# EAGLE schematic M8340E (EAGLE 6.6.0)
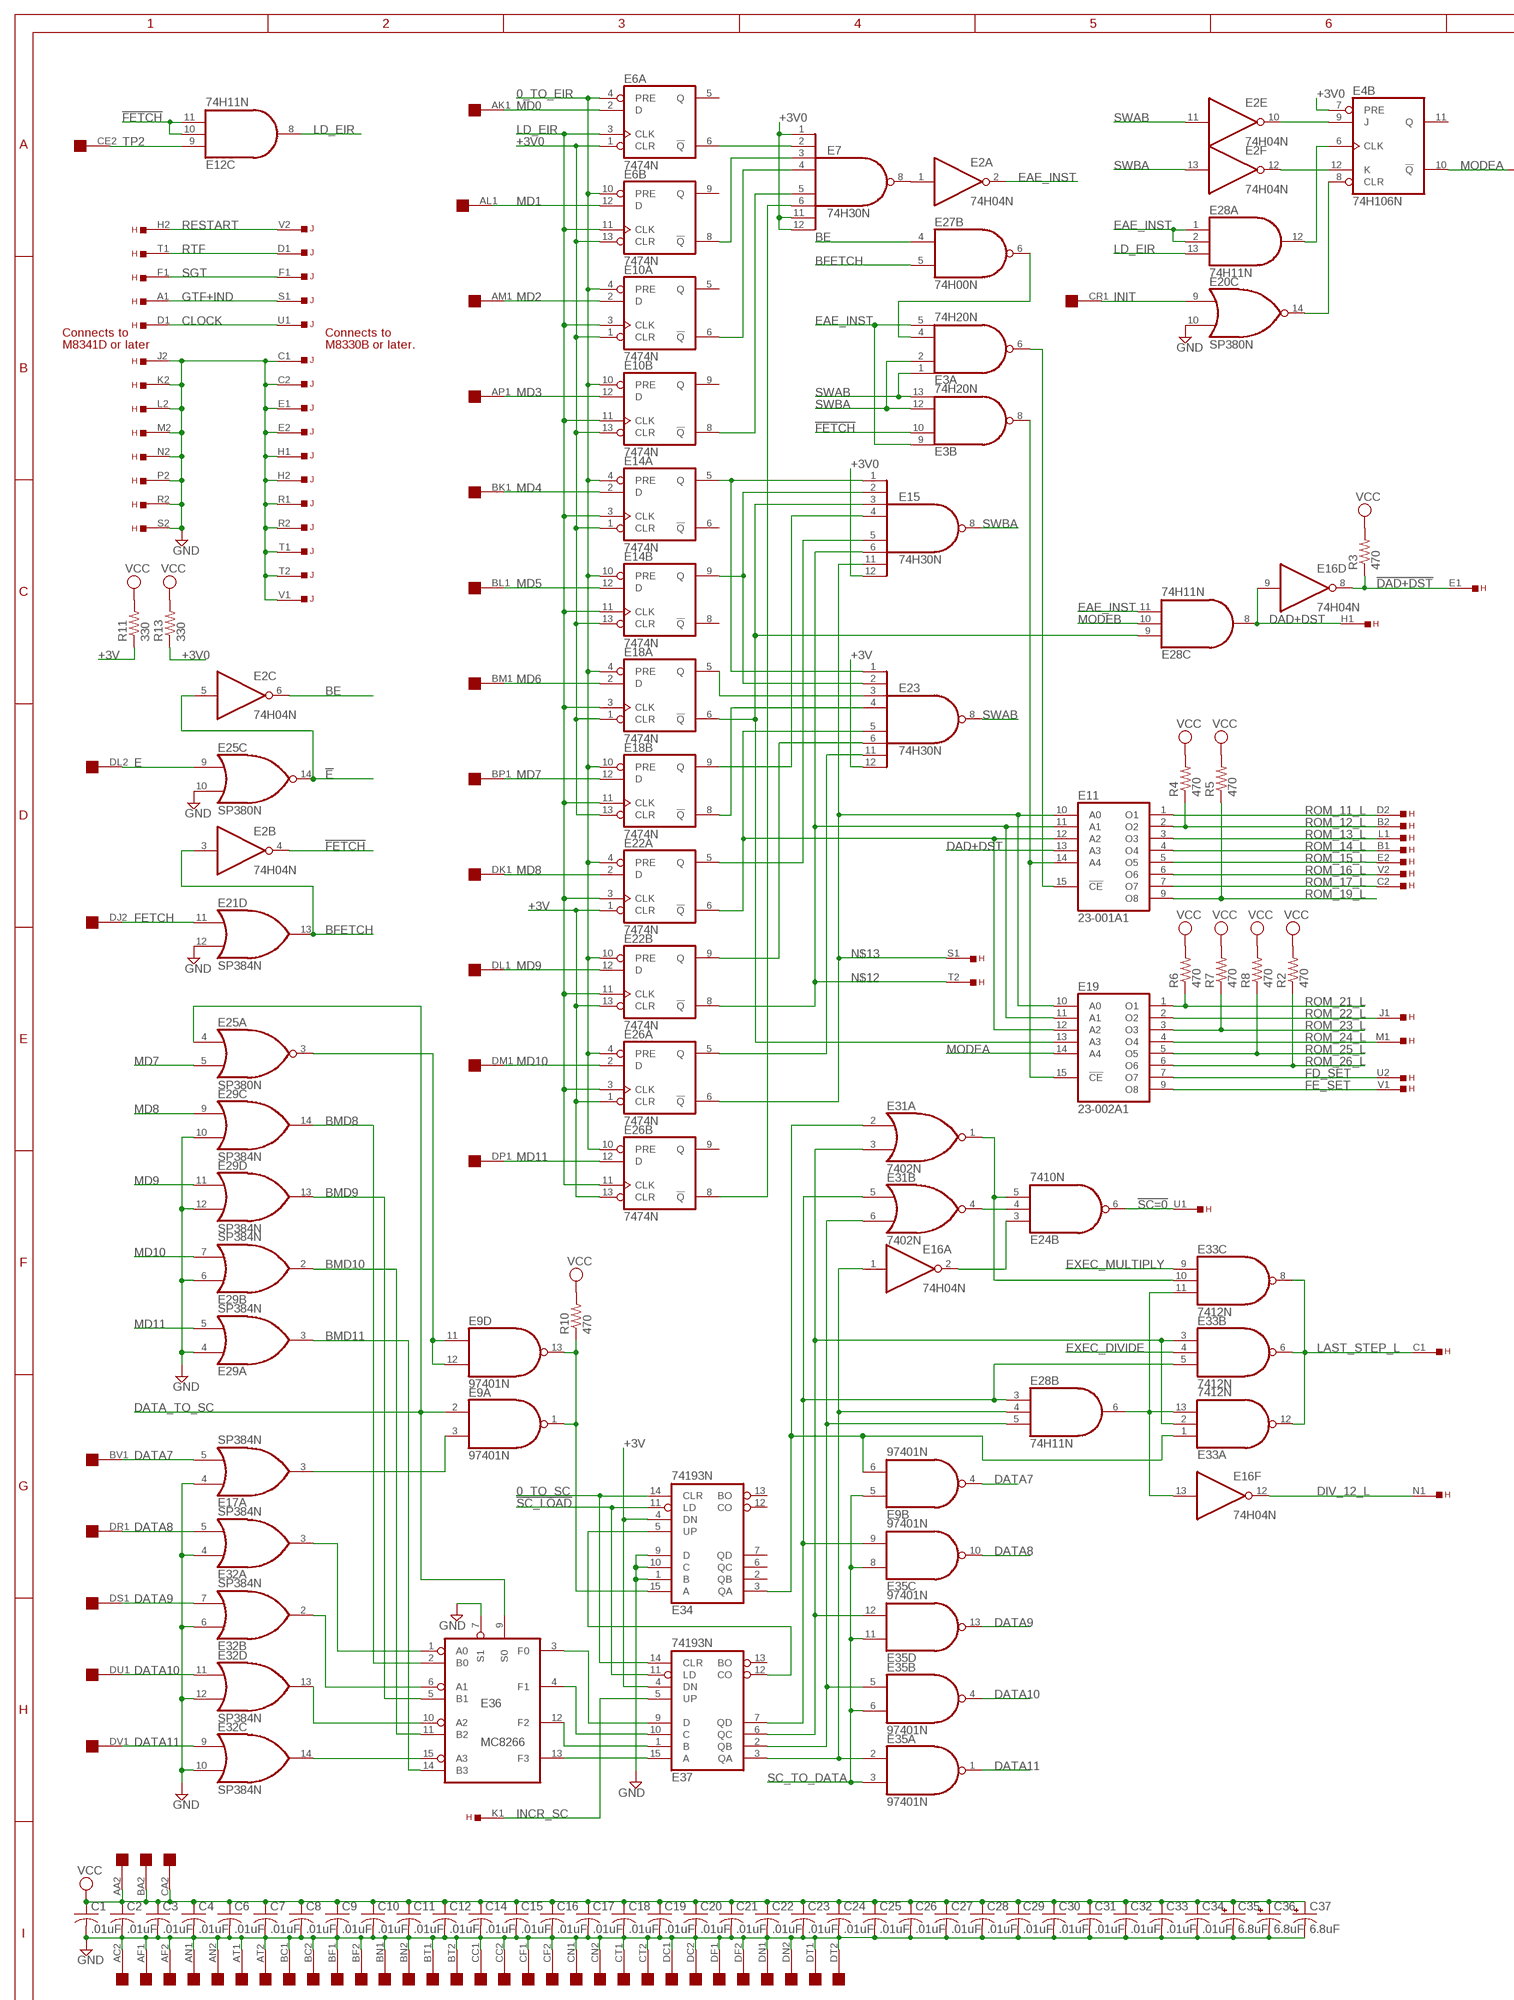
[diagram p0: schematic, sheet 1, part 1 of 2]
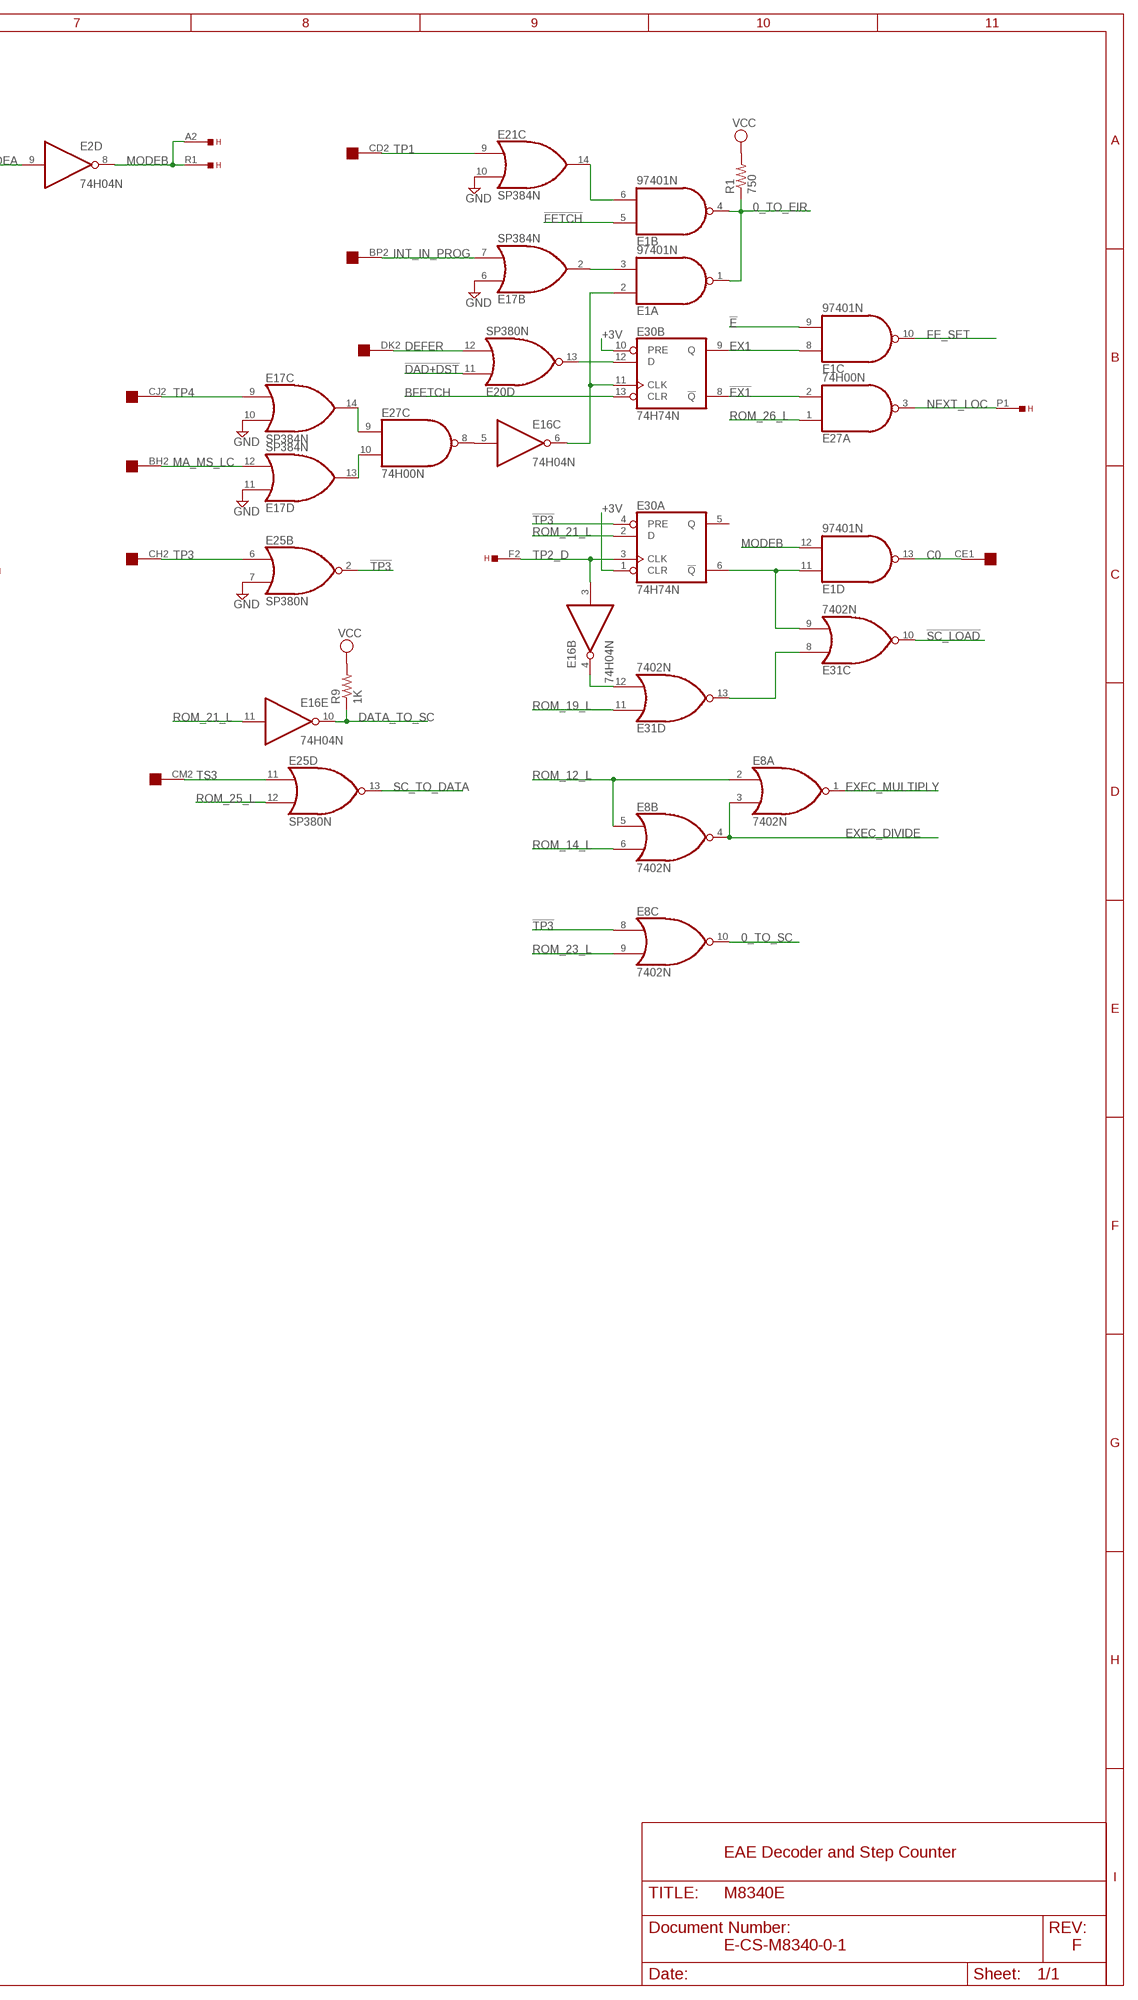
[diagram p1: schematic, sheet 1, part 2 of 2]

## Parts
C1  .01uF  C-US  [C063-025X075]
C2  .01uF  C-US  [C063-025X075]
C3  .01uF  C-US  [C063-025X075]
C4  .01uF  C-US  [C063-025X075]
C6  .01uF  C-US  [C063-025X075]
C7  .01uF  C-US  [C063-025X075]
C8  .01uF  C-US  [C063-025X075]
C9  .01uF  C-US  [C063-025X075]
C10  .01uF  C-US  [C063-025X075]
C11  .01uF  C-US  [C063-025X075]
C12  .01uF  C-US  [C063-025X075]
C14  .01uF  C-US  [C063-025X075]
C15  .01uF  C-US  [C063-025X075]
C16  .01uF  C-US  [C063-025X075]
C17  .01uF  C-US  [C063-025X075]
C18  .01uF  C-US  [C063-025X075]
C19  .01uF  C-US  [C063-025X075]
C20  .01uF  C-US  [C063-025X075]
C21  .01uF  C-US  [C063-025X075]
C22  .01uF  C-US  [C063-025X075]
C23  .01uF  C-US  [C063-025X075]
C24  .01uF  C-US  [C063-025X075]
C25  .01uF  C-US  [C063-025X075]
C26  .01uF  C-US  [C063-025X075]
C27  .01uF  C-US  [C063-025X075]
C28  .01uF  C-US  [C063-025X075]
C29  .01uF  C-US  [C063-025X075]
C30  .01uF  C-US  [C063-025X075]
C31  .01uF  C-US  [C063-025X075]
C32  .01uF  C-US  [C063-025X075]
C33  .01uF  C-US  [C063-025X075]
C34  .01uF  C-US  [C063-025X075]
C35  6.8uF  CPOL-USE20-8AXIAL  [E12-8]
C36  6.8uF  CPOL-USE20-8AXIAL  [E12-8]
C37  6.8uF  CPOL-USE20-8AXIAL  [E12-8]
E1  97401N  74LS01N  [DIL14]
E2  74H04N  7404N  [DIL14]
E3  74H20N  7420N  [DIL14]
E4  74H106N  7476N  [DIL16]
E6  7474N  74S74N  [DIL14]
E7  74H30N  7430N  [DIL14]
E8  7402N  [DIL14]
E9  97401N  74LS01N  [DIL14]
E10  7474N  74S74N  [DIL14]
E11  23-001A1  5600  [DIL16]
E12  74H11N  74S11N  [DIL14]
E14  7474N  74S74N  [DIL14]
E15  74H30N  7430N  [DIL14]
E16  74H04N  7404N  [DIL14]
E17  SP384N  [DIL14]
E18  7474N  74S74N  [DIL14]
E19  23-002A1  5600  [DIL16]
E20  SP380N  [DIL14]
E21  SP384N  [DIL14]
E22  7474N  74S74N  [DIL14]
E23  74H30N  7430N  [DIL14]
E24  7410N  [DIL14]
E25  SP380N  [DIL14]
E26  7474N  74S74N  [DIL14]
E27  74H00N  7400N  [DIL14]
E28  74H11N  74S11N  [DIL14]
E29  SP384N  [DIL14]
E30  74H74N  74S74N  [DIL14]
E31  7402N  [DIL14]
E32  SP384N  [DIL14]
E33  7412N  [DIL14]
E34  74193N  [DIL16]
E35  97401N  74LS01N  [DIL14]
E36  MC8266  [DIL16]
E37  74193N  [DIL16]
H  EDGE-TOP  [EDGE-CON2]
J  EDGE-TOP  [EDGE-CON2]
R1  750  R-US_0207/10  [0207/10]
R2  470  R-US_0207/10  [0207/10]
R3  470  R-US_0207/10  [0207/10]
R4  470  R-US_0207/10  [0207/10]
R5  470  R-US_0207/10  [0207/10]
R6  470  R-US_0207/10  [0207/10]
R7  470  R-US_0207/10  [0207/10]
R8  470  R-US_0207/10  [0207/10]
R9  1K  R-US_0207/10  [0207/10]
R10  470  R-US_0207/10  [0207/10]
R11  330  R-US_0207/10  [0207/10]
R13  330  R-US_0207/10  [0207/10]
U$2  QUAD  [EDGE-CON8]

## Nets
0_TO_EIR: E1.1(A:O) E1.4(B:O) E6.4(A:PRE) E6.10(B:PRE) E10.4(A:PRE) E10.10(B:PRE) E14.4(A:PRE) E14.10(B:PRE) E18.4(A:PRE) E18.10(B:PRE) E22.4(A:PRE) E22.10(B:PRE) E26.4(A:PRE) E26.10(B:PRE) R1.1
0_TO_SC: E8.10(C:O) E34.14(CLR) E37.14(CLR)
!DAD+DST: E16.8(D:O) E20.11(D:I0) H.E1 R3.1
!E: E1.9(C:I1) E2.5(C:I) E25.14(C:O)
!EX1: E27.2(A:I1) E30.8(B:!Q)
!FETCH: E1.5(B:I0) E2.4(B:O) E3.10(B:I1) E12.10(C:I1) E12.11(C:I2)
!INIT: E4.8(B:CLR) E20.14(C:O)
!SC=0: E24.6(B:O) H.U1
!SC_LOAD: E31.10(C:O) E34.11(LD) E37.11(LD)
!TP3: E8.8(C:I0) E25.2(B:O) E30.4(A:PRE)
+3V: E22.1(A:CLR) E22.13(B:CLR) E23.12(I7) E26.1(A:CLR) E26.13(B:CLR) E30.1(A:CLR) E30.10(B:PRE) E34.4(DN) E37.4(DN) R11.1
+3V0: E4.7(B:PRE) E6.1(A:CLR) E6.13(B:CLR) E7.1(I0) E7.11(I6) E7.12(I7) E10.1(A:CLR) E10.13(B:CLR) E14.1(A:CLR) E14.13(B:CLR) E15.12(I7) E18.1(A:CLR) E18.13(B:CLR) R13.1
BE: E2.6(C:O) E27.4(B:I0)
BFETCH: E2.3(B:I) E21.13(D:O) E27.5(B:I1) E30.13(B:CLR)
BMD8: E29.14(C:O) E36.2(B0)
BMD9: E29.13(D:O) E36.5(B1)
BMD10: E29.2(B:O) E36.11(B2)
BMD11: E29.3(A:O) E36.14(B3)
C0: E1.13(D:O) U$2.CE1
CLOCK: H.D1 J.U1
DAD+DST: E11.13(A3) E16.9(D:I) E28.8(C:O) H.H1
DATA7: E9.4(B:O) E17.5(A:I1) U$2.BV1
DATA8: E32.5(A:I1) E35.10(C:O) U$2.DR1
DATA9: E32.7(B:I1) E35.13(D:O) U$2.DS1
DATA10: E32.11(D:I0) E35.4(B:O) U$2.DU1
DATA11: E32.9(C:I0) E35.1(A:O) U$2.DV1
DATA_TO_SC: E9.2(A:I0) E16.10(E:O) E25.4(A:I0) E36.9(S0) R9.1
DEFER: E20.12(D:I1) U$2.DK2
DIV_12_L: E16.12(F:O) H.N1
E: E25.9(C:I0) U$2.DL2
EAE_INST: E2.2(A:O) E3.5(A:I3) E3.9(B:I0) E28.1(A:I0) E28.2(A:I1) E28.11(C:I2)
EX1: E1.8(C:I0) E30.9(B:Q)
EXEC_DIVIDE: E8.3(A:I1) E8.4(B:O) E33.4(B:I1)
EXEC_MULTIPLY: E8.1(A:O) E33.9(C:I0)
FD_SET: E19.7(O7) H.U2
FE_SET: E1.10(C:O) E19.9(O8) H.V1
FETCH: E21.11(D:I0) U$2.DJ2
GND [supply]: C1.2 C2.2 C3.2 C4.2 C6.2 C7.2 C8.2 C9.2 C10.2 C11.2 C12.2 C14.2 C15.2 C16.2 C17.2 C18.2 C19.2 C20.2 C21.2 C22.2 C23.2 C24.2 C25.2 C26.2 C27.2 C28.2 C29.2 C30.2 C31.2 C32.2 C33.2 C34.2 C35.- C36.- C37.- E17.4(A:I0) E17.6(B:I0) E17.10(C:I1) E17.11(D:I0) E20.10(C:I1) E21.10(C:I1) E21.12(D:I1) E25.7(B:I1) E25.10(C:I1) E29.4(A:I0) E29.6(B:I0) E29.10(C:I1) E29.12(D:I1) E32.4(A:I0) E32.6(B:I0) E32.10(C:I1) E32.12(D:I1) E34.1(B) E34.9(D) E34.10(C) E36.7(S1) H.J2 H.K2 H.L2 H.M2 H.N2 H.P2 H.R2 H.S2 J.C1 J.C2 J.E1 J.E2 J.H1 J.H2 J.R1 J.R2 J.T1 J.T2 J.V1 U$2.AC2 U$2.AF1 U$2.AF2 U$2.AN1 U$2.AN2 U$2.AT1 U$2.AT2 U$2.BC1 U$2.BC2 U$2.BF1 U$2.BF2 U$2.BN1 U$2.BN2 U$2.BT1 U$2.BT2 U$2.CC1 U$2.CC2 U$2.CF1 U$2.CF2 U$2.CN1 U$2.CN2 U$2.CT1 U$2.CT2 U$2.DC1 U$2.DC2 U$2.DF1 U$2.DF2 U$2.DN1 U$2.DN2 U$2.DT1 U$2.DT2
GTF+IND: H.A1 J.S1
INCR_SC: E37.5(UP) H.K1
INIT: E20.9(C:I0) U$2.CR1
INT_IN_PROG: E17.7(B:I1) U$2.BP2
LAST_STEP_L: E33.6(B:O) E33.8(C:O) E33.12(A:O) H.C1
LD_EIR: E6.3(A:CLK) E6.11(B:CLK) E10.3(A:CLK) E10.11(B:CLK) E12.8(C:O) E14.3(A:CLK) E14.11(B:CLK) E18.3(A:CLK) E18.11(B:CLK) E22.3(A:CLK) E22.11(B:CLK) E26.3(A:CLK) E26.11(B:CLK) E28.13(A:I2)
MA_MS_LC: E17.12(D:I1) U$2.BH2
MD0: E6.2(A:D) U$2.AK1
MD1: E6.12(B:D) U$2.AL1
MD2: E10.2(A:D) U$2.AM1
MD3: E10.12(B:D) U$2.AP1
MD4: E14.2(A:D) U$2.BK1
MD5: E14.12(B:D) U$2.BL1
MD6: E18.2(A:D) U$2.BM1
MD7: E18.12(B:D) E25.5(A:I1) U$2.BP1
MD8: E22.2(A:D) E29.9(C:I0) U$2.DK1
MD9: E22.12(B:D) E29.11(D:I0) U$2.DL1
MD10: E26.2(A:D) E29.7(B:I1) U$2.DM1
MD11: E26.12(B:D) E29.5(A:I1) U$2.DP1
MODEA: E2.9(D:I) E4.10(B:!Q) E19.14(A4)
MODEB: E1.12(D:I1) E2.8(D:O) E28.10(C:I1) H.A2 H.R1
N$1: E6.6(A:!Q) E7.2(I1)
N$2: E6.8(B:!Q) E7.3(I2)
N$3: E14.5(A:Q) E15.1(I0) E23.1(I0)
N$4: E7.4(I3) E10.6(A:!Q)
N$5: E7.5(I4) E10.8(B:!Q)
N$6: E2.1(A:I) E7.8(O)
N$7: E7.6(I5) E26.8(B:!Q)
N$8: E14.9(B:Q) E15.2(I1) E23.2(I1)
N$9: E15.3(I2) E18.6(A:!Q) E19.13(A3) E28.9(C:I0)
N$10: E15.4(I3) E18.9(B:Q)
N$11: E15.5(I4) E22.5(A:Q)
N$12: E11.11(A1) E15.6(I5) E19.11(A1) E22.8(B:!Q) H.T2
N$13: E11.10(A0) E15.11(I6) E19.10(A0) E26.6(A:!Q) H.S1
N$14: E18.5(A:Q) E23.3(I2)
N$15: E18.8(B:!Q) E23.4(I3)
N$16: E11.12(A2) E19.12(A2) E22.6(A:!Q) E23.5(I4)
N$17: E22.9(B:Q) E23.6(I5)
N$18: E23.11(I6) E26.5(A:Q)
N$19: E31.3(A:I1) E33.2(A:I1) E33.3(B:I0) E35.12(D:I1) E37.6(QC)
N$20: E16.13(F:I) E28.6(B:O) E33.11(C:I2) E33.13(A:I2)
N$21: E3.8(B:O) E11.14(A4) E19.15(!CE)
N$22: E2.12(F:O) E4.12(B:K)
N$23: E2.10(E:O) E4.9(B:J)
N$24: E3.4(A:I2) E27.6(B:O)
N$25: E3.6(A:O) E11.15(!CE)
N$26: E1.11(D:I0) E30.6(A:!Q) E31.9(C:I1)
N$27: E4.6(B:CLK) E28.12(A:O)
N$28: E1.6(B:I1) E21.14(C:O)
N$29: E1.3(A:I1) E17.2(B:O)
N$30: E32.3(A:O) E36.1(A0)
N$31: E32.2(B:O) E36.6(A1)
N$32: E32.13(D:O) E36.10(A2)
N$33: E32.14(C:O) E36.15(A3)
N$34: E36.13(F3) E37.15(A)
N$35: E36.12(F2) E37.1(B)
N$36: E36.4(F1) E37.10(C)
N$37: E36.3(F0) E37.9(D)
N$38: E9.6(B:I1) E31.2(A:I0) E33.1(A:I0) E34.3(QA)
N$39: E16.1(A:I) E28.4(B:I1) E35.2(A:I0) E37.3(QA)
N$40: E28.5(B:I2) E31.6(B:I1) E35.5(B:I0) E37.2(QB)
N$41: E17.13(D:O) E27.10(C:I1)
N$42: E28.3(B:I0) E31.5(B:I0) E33.5(B:I2) E35.9(C:I1) E37.7(QD)
N$43: E9.11(D:I0) E9.12(D:I1) E25.3(A:O)
N$44: E9.1(A:O) E9.13(D:O) E34.15(A) R10.1
N$45: E9.3(A:I1) E17.3(A:O)
N$46: E34.5(UP) E37.12(CO)
N$47: E16.2(A:O) E24.3(B:I0)
N$48: E24.4(B:I1) E31.4(B:O)
N$49: E24.5(B:I2) E31.1(A:O) E33.10(C:I1)
N$50: E17.14(C:O) E27.9(C:I0)
N$51: E16.5(C:I) E27.8(C:O)
N$52: E1.2(A:I0) E16.6(C:O) E30.11(B:CLK)
N$53: E20.13(D:O) E30.12(B:D)
N$54: E31.8(C:I0) E31.13(D:O)
N$55: E16.4(B:O) E31.12(D:I1)
NEXT_LOC: E27.3(A:O) H.P1
RESTART: H.H2 J.V2
ROM_11_L: E11.1(O1) H.D2
ROM_12_L: E8.2(A:I0) E8.5(B:I0) E11.2(O2) H.B2 R4.1
ROM_13_L: E11.3(O3) H.L1
ROM_14_L: E8.6(B:I1) E11.4(O4) H.B1
ROM_15_L: E11.5(O5) H.E2
ROM_16_L: E11.6(O6) H.V2
ROM_17_L: E11.7(O7) H.C2
ROM_19_L: E11.9(O8) E31.11(D:I0) R5.1
ROM_21_L: E16.11(E:I) E19.1(O1) E30.2(A:D) R6.1
ROM_22_L: E19.2(O2) H.J1
ROM_23_L: E8.9(C:I1) E19.3(O3) R7.1
ROM_24_L: E19.4(O4) H.M1
ROM_25_L: E19.5(O5) E25.12(D:I1) R8.1
ROM_26_L: E19.6(O6) E27.1(A:I0) R2.1
RTF: H.T1 J.D1
SC_TO_DATA: E9.5(B:I0) E25.13(D:O) E35.3(A:I1) E35.6(B:I1) E35.8(C:I0) E35.11(D:I0)
SGT: H.F1 J.F1
SWAB: E2.11(E:I) E3.1(A:I0) E3.13(B:I3) E23.8(O)
SWBA: E2.13(F:I) E3.2(A:I1) E3.12(B:I2) E15.8(O)
TP1: E21.9(C:I0) U$2.CD2
TP2: E12.9(C:I0) U$2.CE2
TP2_D: E16.3(B:I) E30.3(A:CLK) H.F2
TP3: E25.6(B:I0) U$2.CH2
TP4: E17.9(C:I0) U$2.CJ2
TS3: E25.11(D:I0) U$2.CM2
VCC [supply]: C1.1 C2.1 C3.1 C4.1 C6.1 C7.1 C8.1 C9.1 C10.1 C11.1 C12.1 C14.1 C15.1 C16.1 C17.1 C18.1 C19.1 C20.1 C21.1 C22.1 C23.1 C24.1 C25.1 C26.1 C27.1 C28.1 C29.1 C30.1 C31.1 C32.1 C33.1 C34.1 C35.+ C36.+ C37.+ R1.2 R2.2 R3.2 R4.2 R5.2 R6.2 R7.2 R8.2 R9.2 R10.2 R11.2 R13.2 U$2.AA2 U$2.BA2 U$2.CA2
Unconnected: E3.3(3:NC) E3.11(11:NC) E4.1(A:CLK) E4.2(A:PRE) E4.3(A:CLR) E4.4(A:J) E4.11(B:Q) E4.14(A:!Q) E4.15(A:Q) E4.16(A:K) E6.5(A:Q) E6.9(B:Q) E8.11(D:I0) E8.12(D:I1) E8.13(D:O) E9.8(C:I0) E9.9(C:I1) E9.10(C:O) E10.5(A:Q) E10.9(B:Q) E12.1(A:I0) E12.2(A:I1) E12.3(B:I0) E12.4(B:I1) E12.5(B:I2) E12.6(B:O) E12.12(A:O) E12.13(A:I2) E14.6(A:!Q) E14.8(B:!Q) E20.2(B:O) E20.3(A:O) E20.4(A:I0) E20.5(A:I1) E20.6(B:I0) E20.7(B:I1) E21.2(B:O) E21.3(A:O) E21.4(A:I0) E21.5(A:I1) E21.6(B:I0) E21.7(B:I1) E24.1(A:I0) E24.2(A:I1) E24.8(C:O) E24.9(C:I0) E24.10(C:I1) E24.11(C:I2) E24.12(A:O) E24.13(A:I2) E26.9(B:Q) E27.11(D:O) E27.12(D:I0) E27.13(D:I1) E30.5(A:Q) E34.2(QB) E34.6(QC) E34.7(QD) E34.12(CO) E34.13(BO) E37.13(BO) J.A1 J.A2 J.B1 J.B2 J.D2 J.F2 J.J1 J.J2 J.K1 J.K2 J.L1 J.L2 J.M1 J.M2 J.N1 J.N2 J.P1 J.P2 J.S2 J.U2 U$2.AA1 U$2.AB1 U$2.AB2 U$2.AC1 U$2.AD1 U$2.AD2 U$2.AE1 U$2.AE2 U$2.AH1 U$2.AH2 U$2.AJ1 U$2.AJ2 U$2.AK2 U$2.AL2 U$2.AM2 U$2.AP2 U$2.AR1 U$2.AR2 U$2.AS1 U$2.AS2 U$2.AU1 U$2.AU2 U$2.AV1 U$2.AV2 U$2.BA1 U$2.BB1 U$2.BB2 U$2.BD1 U$2.BD2 U$2.BE1 U$2.BE2 U$2.BH1 U$2.BJ1 U$2.BJ2 U$2.BK2 U$2.BL2 U$2.BM2 U$2.BR1 U$2.BR2 U$2.BS1 U$2.BS2 U$2.BU1 U$2.BU2 U$2.BV2 U$2.CA1 U$2.CB1 U$2.CB2 U$2.CD1 U$2.CH1 U$2.CJ1 U$2.CK1 U$2.CK2 U$2.CL1 U$2.CL2 U$2.CM1 U$2.CP1 U$2.CP2 U$2.CR2 U$2.CS1 U$2.CS2 U$2.CU1 U$2.CU2 U$2.CV1 U$2.CV2 U$2.DA1 U$2.DA2 U$2.DB1 U$2.DB2 U$2.DD1 U$2.DD2 U$2.DE1 U$2.DE2 U$2.DH1 U$2.DH2 U$2.DJ1 U$2.DM2 U$2.DP2 U$2.DR2 U$2.DS2 U$2.DU2 U$2.DV2

## Notes on the sheet
- Connects to | Connects to
- M8341D or later | M8330B or later.
- EAE Decoder and Step Counter
- E-CS-M8340-0-1 | F

## Power pins joined to a net without a drawn wire
GND: E1.7(P:GND) E2.7(P:GND) E3.7(P:GND) E4.13(P:GND) E6.7(P:GND) E7.7(GND) E8.7(P:GND) E9.7(P:GND) E10.7(P:GND) E11.8(GND) E12.7(P:GND) E14.7(P:GND) E15.7(GND) E16.7(P:GND) E17.1(GND) E18.7(P:GND) E19.8(GND) E20.1(P:GND) E21.1(GND) E22.7(P:GND) E23.7(GND) E24.7(P:GND) E25.1(P:GND) E26.7(P:GND) E27.7(P:GND) E28.7(P:GND) E29.1(GND) E30.7(P:GND) E31.7(P:GND) E32.1(GND) E33.7(P:GND) E34.8(GND) E35.7(P:GND) E36.8(GND) E37.8(GND)
VCC: E1.14(P:VCC) E2.14(P:VCC) E3.14(P:VCC) E4.5(P:VCC) E6.14(P:VCC) E7.14(VCC) E8.14(P:VCC) E9.14(P:VCC) E10.14(P:VCC) E11.16(VCC) E12.14(P:VCC) E14.14(P:VCC) E15.14(VCC) E16.14(P:VCC) E17.8(VCC) E18.14(P:VCC) E19.16(VCC) E20.8(P:VCC) E21.8(VCC) E22.14(P:VCC) E23.14(VCC) E24.14(P:VCC) E25.8(P:VCC) E26.14(P:VCC) E27.14(P:VCC) E28.14(P:VCC) E29.8(VCC) E30.14(P:VCC) E31.14(P:VCC) E32.8(VCC) E33.14(P:VCC) E34.16(VCC) E35.14(P:VCC) E36.16(VCC) E37.16(VCC)

## Library data of the parts
C1-C4 C6-C12 C14-C34 = dec-con:C-US: Capacitors with funky DEC lead spacing.
C35-C37 = dec-con:CPOL-USE20-8AXIAL: A 0.8 inch electrolytic.
E1 E9 E35 = 74xx-us:74*01: Quad 2-input NAND gate, open collector
E2 E16 = 74xx-us:74*04: Hex INVERTER
E3 = dec-con:74*20: Dual 4-input NAND gate
E4 = 74xx-us:74*76: Dual J-K FLIP FLOP, preset and clear
E6 E10 E14 E18 E22 E26 E30 = 74xx-us:74*74: Dual D type positive edge triggered FLIP FLOP, preset and clear
E7 E15 E23 = 74xx-us:74*30: 8-input NAND gate
E8 E31 = 74xx-us:74*02: Quad 2-input NOR gate
E11 E19 = memory:5600: MEMORY
E12 E28 = 74xx-us:74*11: Triple 3-input AND gate
E17 E21 E29 E32 = dec-con:SP384: Quad OR gate
E20 E25 = dec-con:SP380: Quad NOR gate (use 8640)
E24 = 74xx-us:74*10: Triple 3-input NAND gate
E27 = 74xx-us:74*00: Quad 2-input NAND gate
E33 = 74xx-us:74*12: Triple 3-input NAND gate, open collector
E34 E37 = dec-con:74*193: Synchronous 4-bit UP/DOWN COUNTER
E36 = dec-con:MC8266: Quad 2-1 selector
H J = dec-con:EDGE-TOP: Labeled DEC edge connector, suitable for top connector.
R1-R11 R13 = rcl:R-US_: RESISTOR, American symbol
U$2 = dec-con:QUAD: Quad-Height DEC board

## Net classes
1 supply: width 0.813 mm